# Altium project 电压过零比较器.PrjPCB
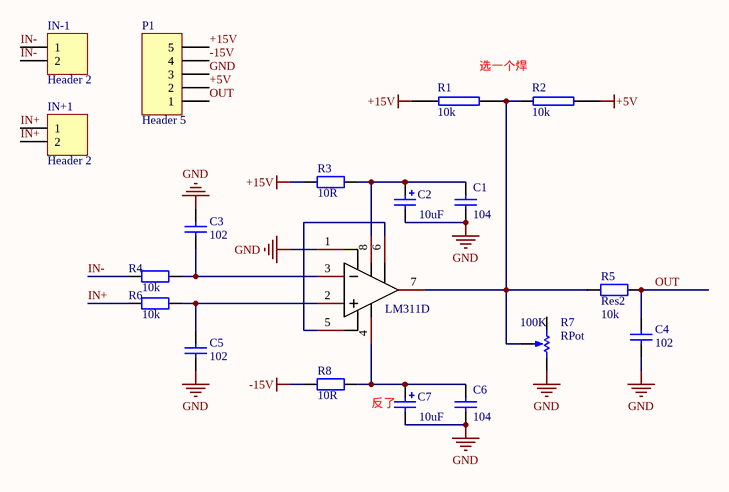
[diagram p0: 电压过零比较器.SchDoc]
1 sheet, 19 parts. Net scope: global (net labels, ports and power ports of the same name join across sheets).
Board file: 电压过零比较器.PcbDoc

## Sheet 电压过零比较器.SchDoc
size A4

### Parts
C1  value 104  [0805]  (hidden comment: Cap)
C2  value 10uF  [1210]  (hidden comment: Cap Pol2)
C3  value 102  [0805]  (hidden comment: Cap)
C4  value 102  [0805]  (hidden comment: Cap)
C5  value 102  [0805]  (hidden comment: Cap)
C6  value 104  [0805]  (hidden comment: Cap)
C7  value 10uF  [1210]  (hidden comment: Cap Pol2)
IN+1  Header 2  [POWER_2PIN 1]
IN-1  Header 2  [POWER_2PIN 1]
P1  Header 5  [POWER_5PIN]
R1  10k  [AXIAL-0.4]
R2  10k  [AXIAL-0.4]
R3  value 10R  [0805]  (hidden comment: Res2)
R4  value 10k  [0805]  (hidden comment: Res2)
R5  Res2  value 10k  [0805]
R6  value 10k  [0805]  (hidden comment: Res2)
R7  RPot  value 100K  [VR5]
R8  value 10R  [0805]  (hidden comment: Res2)
U1  LM311D  [SO8]  (value not drawn)

### Nets
+5V: P1.2 R2.2
+15V: P1.5 R1.1 R3.2
-15V: P1.4 R8.2
GND: C1.1 C2.2 C3.2 C4.1 C5.1 C6.1 C7.2 P1.3 R7.3(BOT) U1.1(GROUND)
IN+: IN+1.1 IN+1.2 R6.2
IN-: IN-1.1 IN-1.2 R4.2
OUT: C4.2 P1.1 R5.2
NetC1_2: C1.2 C2.1 R3.1 U1.8(V+)
NetC3_1: C3.1 R4.1 U1.3(IN-)
NetC5_2: C5.2 R6.1 U1.2(IN+)
NetC6_2: C6.2 C7.1 R8.1 U1.4(VCC-)
NetR1_2: R1.2 R2.1 R5.1 R7.2(TAP) U1.7(OUT)
NetU1_5: U1.5(BALANCE) U1.6(STROBE/BALANCE)

Not connected (* = marked no-connect by the designer): R7 1(TOP)

### Notes on the sheet
- 选一个焊
- (near U1) LM311D
- 反了

### Library data of the parts
C1 C3-C6 = Cap: 电容0805; Published: 8-Jun-2000; LatestRevisionDate: 17-Jul-2002; LatestRevisionNote: Re-released for DXP Platform.; PackageReference: RAD-0.3; Publisher: Altium Limited
C2 C7 = Cap Pol2: Polarized Capacitor (Axial) 1210; Published: 8-Jun-2000; LatestRevisionDate: 17-Jul-2002; LatestRevisionNote: Re-released for DXP Platform.; PackageReference: POLAR0.8; Publisher: Altium Limited
IN+1 IN-1 = Header 2: Header, 2-Pin; LatestRevisionDate: 17-Jul-2002; LatestRevisionNote: Re-released for DXP Platform.; Publisher: Altium Limited
P1 = Header 5: Header, 5-Pin; LatestRevisionDate: 17-Jul-2002; LatestRevisionNote: Re-released for DXP Platform.; Publisher: Altium Limited
R1 R2 = RES2: 电阻
R3 R4 R6 R8 = Res2: 电阻; Published: 8-Jun-2000; LatestRevisionDate: 17-Jul-2002; LatestRevisionNote: Re-released for DXP Platform.; PackageReference: AXIAL-0.4; Publisher: Altium Limited
R5 = Res2: Resistor; Published: 8-Jun-2000; LatestRevisionDate: 17-Jul-2002; LatestRevisionNote: Re-released for DXP Platform.; PackageReference: AXIAL-0.4; Publisher: Altium Limited; PackageDescription: Axial Device, Thru-Hole; 2 Leads; 0.4 in Pin Spacing
R7 = RPot: Potentiometer; Sim Note: Enter the Resistance value and the set point into parameter fields.; Set Position: 0.5; Published: 8-Jun-2000; LatestRevisionDate: 17-Jul-2002; LatestRevisionNote: Re-released for DXP Platform.; PackageReference: VR5; Publisher: Altium Limited
U1 = LM311D: Add into BOM: yes; Name: LM311D; Symbol: LM311D; Device: LM311D; LCSC Part Name: LM311D; Supplier Part: C2972032; Manufacturer Part: LM311D; Supplier Footprint: SO-8; JLCPCB Part Class: Extended Part; Datasheet: https://atta.szlcsc.com/upload/public/pdf/source/20220209/DAF631F51C09E64CBB64CC28064FCB71.pdf; Supplier: LCSC; Convert to PCB: yes